# Altium project Lync-main-board.PrjPcb
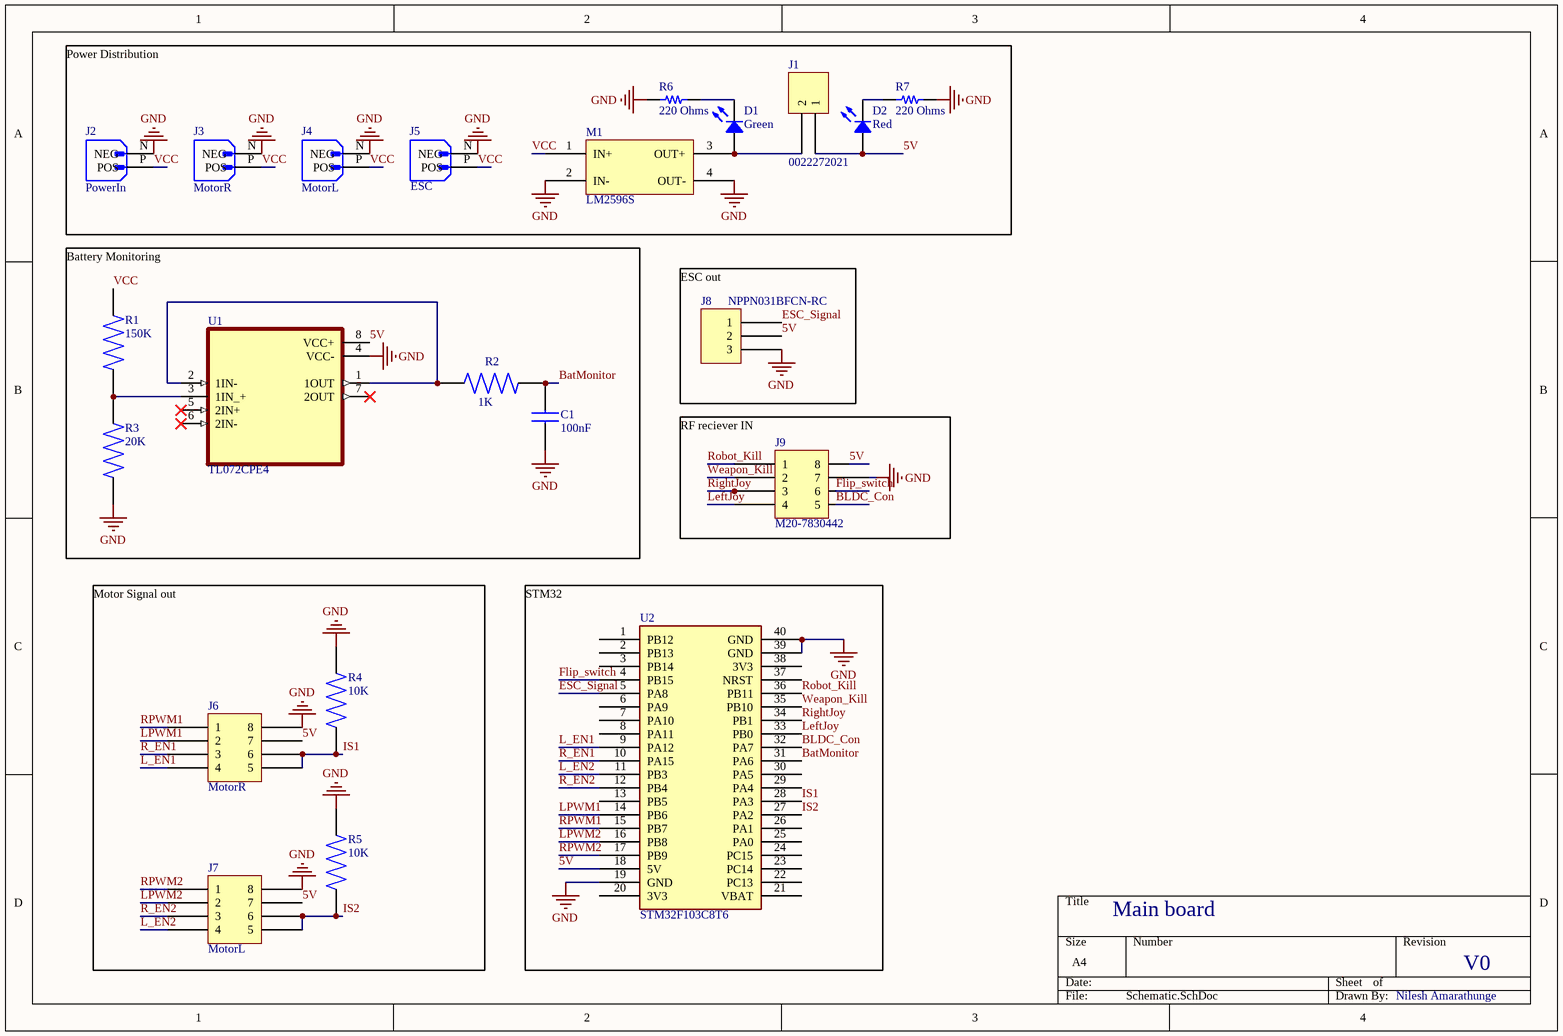
[diagram p0: Schematic.SchDoc]
1 sheet, 22 parts. Net scope: global (net labels, ports and power ports of the same name join across sheets).
Board file: PCB.PcbDoc

## Sheet Schematic.SchDoc
size A4; SheetNumber: 1; SheetTotal: 1

### Parts
C1  100nF  [C320C]
D1  Green  [LED 0805_2012 GREEN]
D2  Red  [LED 0805_2012 RED]
J1  0022272021  [MOLEX KK 0022272021]
J2  PowerIn  [AMASS_XT60-M]
J3  MotorR  [AMASS_XT60-M]
J4  MotorL  [AMASS_XT60-M]
J5  ESC  [AMASS_XT60-M]
J6  MotorR  [HARWIN M20-7830445]
J7  MotorL  [HARWIN M20-7830445]
J8  NPPN031BFCN-RC  [SULLINS NPPN031BFCN]
J9  M20-7830442  [HARWIN M20-7830445]
M1  LM2596S  [LM2596S]
R1  150K  [RESAD1869W81L1270D457]
R2  1K  [RESAD1869W81L1270D457]
R3  20K  [RESAD1869W81L1270D457]
R4  10K  [RESAD1869W81L1270D457]
R5  10K  [RESAD1869W81L1270D457]
R6  220 Ohms  [RES 0805_2012]
R7  220 Ohms  [RES 0805_2012]
U1  TL072CPE4  [DIP794W45P254L959H508Q8]
U2  STM32F103C8T6  [Stm32 BluePill]

### Nets
GND: C1.1 J2.N(NEG) J3.N(NEG) J4.N(NEG) J5.N(NEG) J6.8 J7.8 J8.3 J9.7 M1.2(IN-) M1.4(OUT-) R3.1 R4.1 R5.1 R6.1 R7.2 U1.4(VCC-) U2.19(GND) U2.39(GND) U2.40(GND)
5V: D2.1 J1.1 J6.7 J7.7 J8.2 J9.8 U1.8(VCC+) U2.18(5V)
BatMonitor: C1.2 R2.1 U2.31(PA6)
BLDC_Con: J9.5 U2.32(PA7)
ESC_Signal: J8.1 U2.5(PA8)
Flip_switch: J9.6 U2.4(PB15)
IS1: J6.5 J6.6 R4.2 U2.28(PA3)
IS2: J7.5 J7.6 R5.2 U2.27(PA2)
L_EN1: J6.4 U2.9(PA12)
L_EN2: J7.4 U2.11(PB3)
LeftJoy: J9.4 U2.33(PB0)
LPWM1: J6.2 U2.14(PB6)
LPWM2: J7.2 U2.16(PB8)
R_EN1: J6.3 U2.10(PA15)
R_EN2: J7.3 U2.12(PB4)
RightJoy: J9.3 U2.34(PB1)
Robot_Kill: J9.1 U2.36(PB11)
RPWM1: J6.1 U2.15(PB7)
RPWM2: J7.1 U2.17(PB9)
VCC: J2.P(POS) J3.P(POS) J4.P(POS) J5.P(POS) M1.1(IN+) R1.2
Weapon_Kill: J9.2 U2.35(PB10)
NetD1_1: D1.1 J1.2 M1.3(OUT+)
NetD1_2: D1.2 R6.2
NetD2_2: D2.2 R7.1
NetR1_1: R1.1 R3.2 U1.3(1IN_+)
NetR2_2: R2.2 U1.1(1OUT) U1.2(1IN-)

Not connected (* = marked no-connect by the designer): U1 5(2IN+)* 6(2IN-)* 7(2OUT)*; U2 1(PB12) 2(PB13) 3(PB14) 6(PA9) 7(PA10) 8(PA11) 13(PB5) 20(3V3) 21(VBAT) 22(PC13) 23(PC14) 24(PC15) 25(PA0) 26(PA1) 29(PA4) 30(PA5) 37(NRST) 38(3V3)

### Notes on the sheet
- Power Distribution
- (near J8) ESC out
- Battery Monitoring
- (near J9) RF reciever IN
- Main board
- Motor Signal out
- (near U2) STM32
- V0
- Nilesh Amarathunge

### Library data of the parts
C1 = C320C104M5U5TA: C320 C 100nF Ceramic Multilayer Capacitor, 50 VDC, +85degC, Z5U Dielec, +/-20% | KEMET C320C104M5U5TA; SnapEDA_Link: https://www.snapeda.com/parts/C320C104M5U5TA/KEMET/view-part/?ref=snap; Package: Radial KEMET; Value: *; MF: KEMET; MP: C320C104M5U5TA; Check_prices: https://www.snapeda.com/parts/C320C104M5U5TA/KEMET/view-part/?ref=eda
D1 = APHCM2012ZGC/G-F01: LED GREEN CLEAR 2SMD; Manufacturer: Kingbright; Configuration: Independent; Current - Test: 20mA; Lens Color: Colorless; Lens Size: 1.25mm x 1.20mm; Lens Style: Rectangle with Flat Top; Millicandela Rating: 700mcd; Viewing Angle: 110°; Voltage - Forward (Vf) (Typ): 3.2V; Wavelength - Dominant: 525nm; Wavelength - Peak: 520nm; Part Number: APHCM2012ZGC/G-F01; Color: Green; ComponentLink1Description: Datasheet; ComponentLink1URL: http://www.kingbrightusa.com/images/catalog/SPEC/APHCM2012ZGC-G-F01.pdf; ComponentLink2Description: DigiKey Link; ComponentLink2URL: https://www.digikey.com/en/products/detail/kingbright/APHCM2012ZGC-G-F01/7318972; Device Package: 0805 (2012 Metric); Height (Max): 0.50mm; LastUpdated: 2024-06-03 8:00:29 PM; Lens Transparency: Clear; Lifecycle Status: Active; Minimum Order: 1; Mounting Type: Surface Mount; Package / Case: 0805 (2012 Metric); Packaging: TapeAndReel; PartId: 255; Part Status: Active; Price: 0.25; Series: -; Size / Dimension: 2.00mm L x 1.25mm W; Supplier 1: DigiKey; Supplier Part Number 1: 754-2119-1-ND; Supplier Device Package: 2-SMD; Value: Green
D2 = 5990110007F: LED RED 0805 SMD; Manufacturer: Dialight; Configuration: Standard; Current - Test: 20mA; Lens Color: 0.80mm; Lens Size: 1.40mm x 1.25mm; Lens Style: Rectangle with Flat Top; Millicandela Rating: 29mcd; Viewing Angle: 140°; Voltage - Forward (Vf) (Typ): 2.1V; Wavelength - Dominant: 633nm; Part Number: 5990110007F; Color: Red; ComponentLink1Description: Datasheet; ComponentLink1URL: http://www.dialightsignalsandcomponents.com/Assets/Brochures_And_Catalogs/Indication/CBI_SMD_new/Dialight_CBI_data_599-0805_Apr2018.pdf; ComponentLink2Description: DigiKey Link; ComponentLink2URL: https://www.digikey.com/en/products/detail/dialight/5990110007F/9385408; Device Package: 0805 (2012 Metric); Height (Max): 0.80mm; LastUpdated: 2024-06-03 8:00:07 PM; Lifecycle Status: Active; Minimum Order: 1; Mounting Type: Surface Mount; Package / Case: 0805 (2012 Metric); Packaging: TapeAndReel; PartId: 308; Part Status: Active; Price: 0.04; Series: 599; Size / Dimension: 2.00mm L x 1.25mm W; Supplier 1: DigiKey; Supplier Part Number 1: 350-4353-1-ND; Supplier Device Package: 0805; Value: Red
J1 = 0022272021: CONN HEADER VERT 2POS 2.54MM; Manufacturer: Molex; Contact Length - Mating: 0.295" (7.49mm); Contact Length - Post: 0.140" (3.56mm); Material Flammability Rating: UL94 V-0; Number of Positions: 2; Number of Positions Loaded: All; Overall Contact Length: 0.560" (14.22mm); Pitch - Mating: 0.100" (2.54mm); Shrouding: Shrouded - 1 Wall; Style: Board to Cable/Wire; Part Number: 0022272021; ComponentLink1Description: Datasheet; ComponentLink1URL: https://www.molex.com/pdm_docs/sd/022272021_sd.pdf; ComponentLink2Description: DigiKey Link; ComponentLink2URL: http://digikey.com/product-detail/en/molex/0022272021/WM4111-ND/1130577; Connector Type: Header; Contact Finish - Mating: Tin; Contact Finish - Post: Tin; Contact Finish Thickness - Mating: 100.0µin (2.54µm); Contact Material: Brass; Contact Shape: Square; Contact Type: Male Pin; Fastening Type: Friction Lock; Insulation Color: Natural; Insulation Height: 0.461" (11.70mm); Insulation Material: Polyamide (PA), Nylon; LastUpdated: 2020-01-12 11:51:43 PM; Lifecycle Status: Active; Minimum Order: 1; Mounting Type: Through Hole; Number of Rows: 1; Packaging: Bulk; PartId: 76; Part Status: Active; Price: 0.27; Series: KK 6410; Supplier 1: DigiKey; Supplier Part Number 1: WM4111-ND; Termination: Solder
J2-J5 = XT60-M: Plug; DC supply; XT60; male; PIN: 2; for cable; soldered; 30A; 500V; MF: AMASS; SnapEDA_Link: https://www.snapeda.com/parts/XT60-M/AMASS/view-part/?ref=snap; Package: Package; Value: *; MP: XT60-M; Check_prices: https://www.snapeda.com/parts/XT60-M/AMASS/view-part/?ref=eda
J6 J7 J9 = M20-7830442: CONN RCPT 8POS 0.1 GOLD PCB; Manufacturer: Harwin Inc.; Connector Type: Receptacle; Contact Length - Post: 0.118" (3.00mm); Current Rating (Amps): 3A; Mated Stacking Heights: 11.04mm, 12.63mm; Material Flammability Rating: UL94 V-0; Number of Positions: 8; Number of Positions Loaded: All; Pitch - Mating: 0.100" (2.54mm); Style: Board to Board or Cable; Part Number: M20-7830442; ComponentLink1Description: Datasheet; ComponentLink1URL: https://cdn.harwin.com/pdfs/C001XX_M20_Series_Connectors.pdf; ComponentLink2Description: DigiKey Link; ComponentLink2URL: http://digikey.com/product-detail/en/harwin-inc/M20-7830442/952-1789-ND/3727758; Contact Finish - Mating: Gold; Contact Finish - Post: Tin; Contact Finish Thickness - Mating: Flash; Contact Type: Female Socket; Fastening Type: Push-Pull; Insulation Color: Black; Insulation Height: 0.335" (8.51mm); LastUpdated: 2022-09-21 7:04:26 PM; Lifecycle Status: Active; Minimum Order: 1; Mounting Type: Through Hole; Number of Rows: 2; Operating Temperature: -40°C ~ 105°C; Packaging: Tube; Part Status: Active; Price: 1.36; Row Spacing - Mating: 0.100" (2.54mm); Series: M20; Supplier 1: DigiKey; Supplier Part Number 1: 952-1789-ND; Termination: Solder
J8 = NPPN031BFCN-RC: CONN HDR 3POS 0.079 GOLD PCB; Manufacturer: Sullins Connector Solutions; Connector Type: Header; Contact Length - Post: 0.094" (2.40mm); Current Rating (Amps): 2A; Material Flammability Rating: UL94 V-0; Number of Positions: 3; Number of Positions Loaded: All; Pitch - Mating: 0.079" (2.00mm); Style: Board to Board; Part Number: NPPN031BFCN-RC; ComponentLink1Description: Datasheet; ComponentLink1URL: https://drawings-pdf.s3.amazonaws.com/10483.pdf; ComponentLink2Description: DigiKey Link; ComponentLink2URL: https://www.digikey.com/en/products/detail/sullins-connector-solutions/NPPN031BFCN-RC/804805; Contact Finish - Mating: Gold; Contact Finish - Post: Gold; Contact Finish Thickness - Mating: Flash; Contact Type: Female Socket; Fastening Type: Push-Pull; Insulation Color: Black; Insulation Height: 0.173" (4.40mm); LastUpdated: 2022-06-21 2:42:20 PM; Lifecycle Status: Active; Minimum Order: 1; Mounting Type: Through Hole; Number of Rows: 1; Operating Temperature: -40°C ~ 105°C; Packaging: Tube; Part Status: Active; Price: 0.25; Series: -; Supplier 1: DigiKey; Supplier Part Number 1: S5751-03-ND; Termination: Solder
R1-R5 = ALSR0310K00FE12: Package: None; Price: None; Value: *; MP: ALSR0310K00FE12; Availability: Unavailable
R6 R7 = ESR10EZPF2200: RES SMD 220 OHM 1% 0.4W 0805; Manufacturer: Rohm Semiconductor; Power (Watts): 0.4W, 2/5W; Temperature Coefficient: ±100ppm/°C; Part Number: ESR10EZPF2200; Value: 220 Ohms; ComponentLink1Description: Datasheet; ComponentLink1URL: https://www.rohm.com/datasheet/ESR01MZPF/esr-e; ComponentLink2Description: DigiKey Link; ComponentLink2URL: https://www.digikey.com/en/products/detail/rohm-semiconductor/ESR10EZPF2200/1983511; Composition: Thick Film; Device Package: 0805 (2012 Metric); Features: Automotive AEC-Q200, Pulse Withstanding; Height - Seated (Max): 0.026" (0.65mm); LastUpdated: 2024-02-08 9:02:37 PM; Lifecycle Status: Active; Minimum Order: 1; Number of Terminations: 2; Operating Temperature: -55°C ~ 155°C; Package / Case: 0805 (2012 Metric); Packaging: TapeAndReel; PartId: 28037; Part Status: Active; Price: 0.02; Ratings: AEC-Q200; Resistance: 220 Ohms; Series: ESR; Size / Dimension: 0.079" L x 0.049" W (2.00mm x 1.25mm); Supplier 1: DigiKey; Supplier Part Number 1: RHM220AECT-ND; Supplier Device Package: 0805; Tolerance: ±1%
U1 = TL072CPE4: Dual Low-Noise JFET-Input General-Purpose Operational Amplifier 8-PDIP 0 to 70; MF: Texas Instruments; SnapEDA_Link: https://www.snapeda.com/parts/TL072CPE4/Texas+Instruments/view-part/?ref=snap; Package: PDIP-8 Texas; Value: *; MP: TL072CPE4; Check_prices: https://www.snapeda.com/parts/TL072CPE4/Texas+Instruments/view-part/?ref=eda
U2 = BluePill: Designed By @Alixahedi